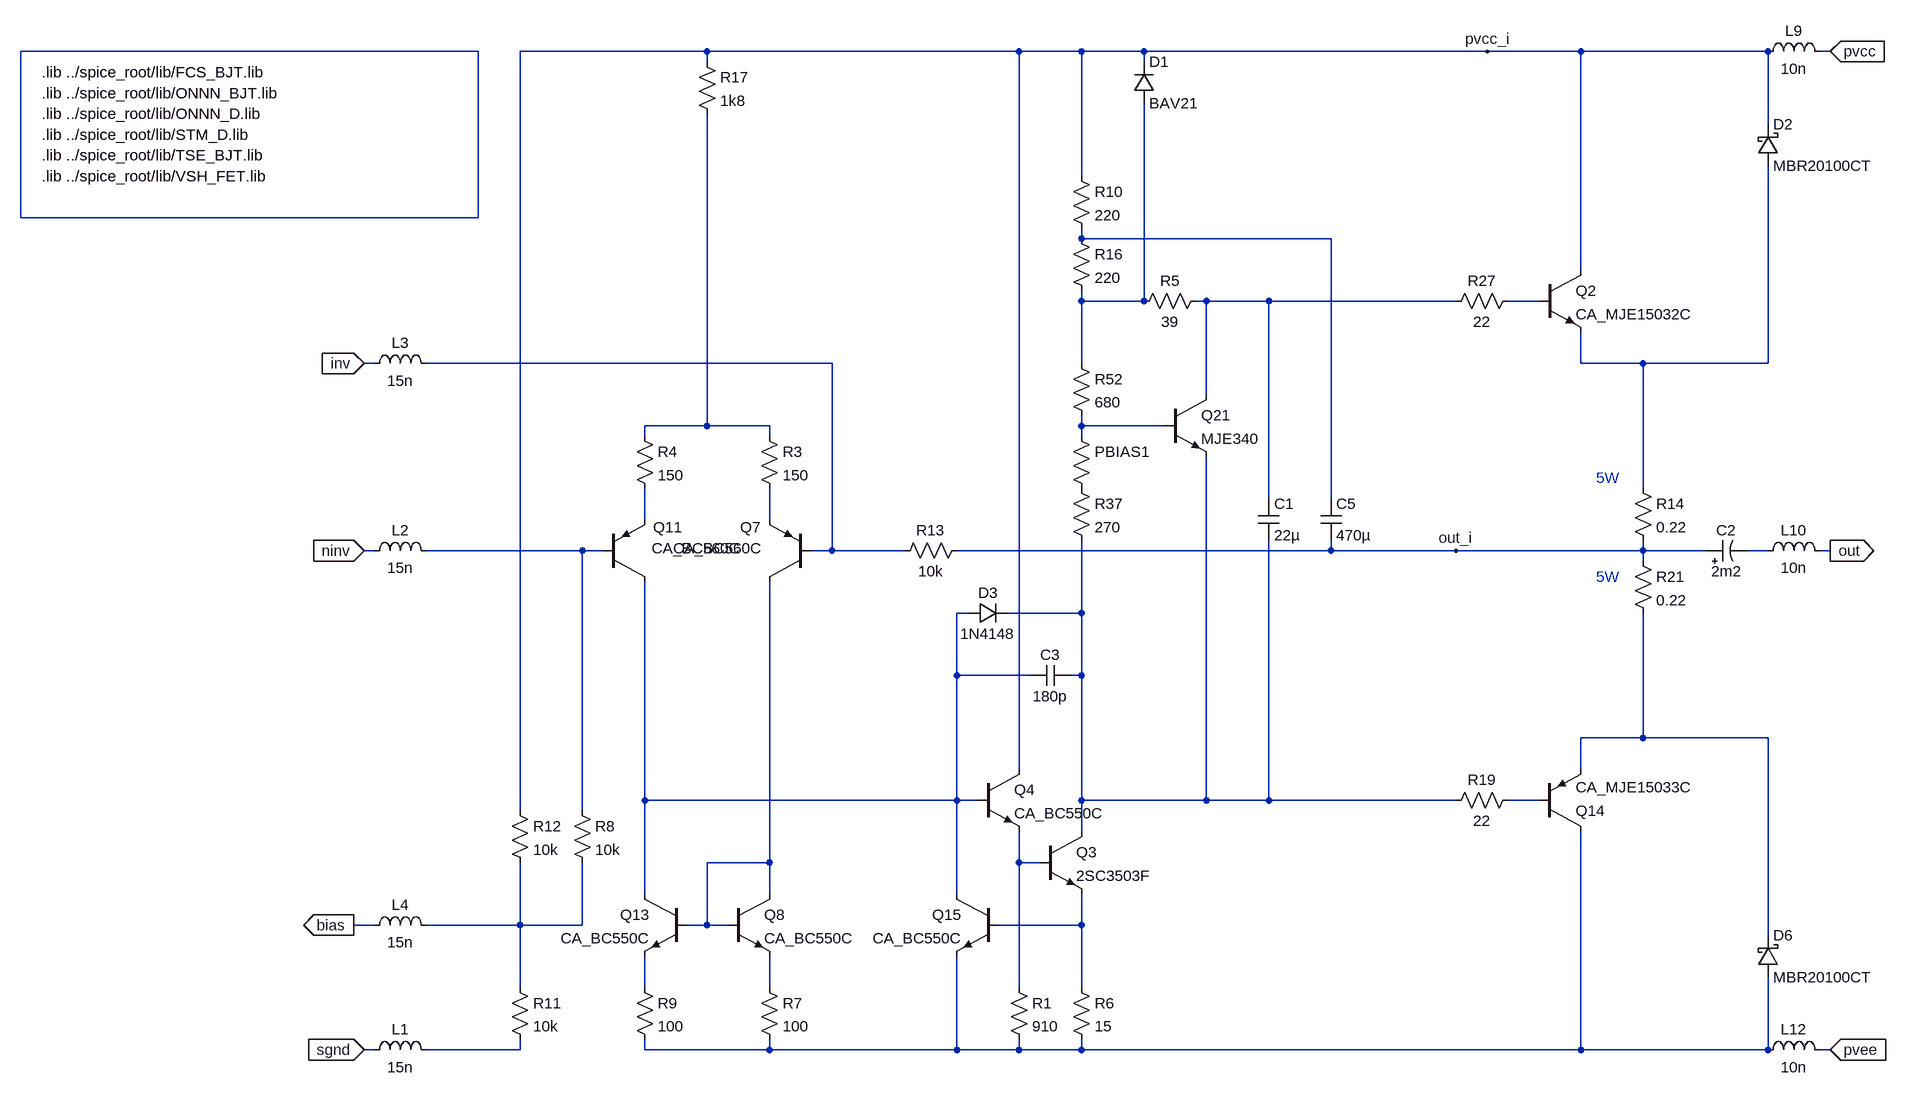
[diagram p0: schematic pab3bbb-sewa-module.asc]
pab3bbb-sewa-module.asc, the LTspice schematic file:
Version 4
SHEET 1 6124 2336
WIRE 160 -992 -128 -992
WIRE 640 -992 160 -992
WIRE 736 -992 640 -992
WIRE 832 -992 736 -992
WIRE 1360 -992 832 -992
WIRE 1504 -992 1360 -992
WIRE 1792 -992 1504 -992
WIRE 1888 -992 1872 -992
WIRE 160 -976 160 -992
WIRE 832 -976 832 -992
WIRE 1792 -880 1792 -992
WIRE 736 -800 736 -992
WIRE 736 -704 736 -720
WIRE 1120 -704 736 -704
WIRE 1504 -656 1504 -992
WIRE 736 -608 736 -624
WIRE 832 -608 832 -912
WIRE 832 -608 736 -608
WIRE 928 -608 912 -608
WIRE 1024 -608 928 -608
WIRE 1312 -608 1024 -608
WIRE 1440 -608 1392 -608
WIRE -352 -512 -368 -512
WIRE 352 -512 -272 -512
WIRE 736 -512 736 -608
WIRE 1504 -512 1504 -560
WIRE 1600 -512 1504 -512
WIRE 1792 -512 1792 -816
WIRE 1792 -512 1600 -512
WIRE 928 -464 928 -608
WIRE 160 -416 160 -896
WIRE 160 -416 64 -416
WIRE 256 -416 160 -416
WIRE 736 -416 736 -432
WIRE 864 -416 736 -416
WIRE 64 -400 64 -416
WIRE 256 -400 256 -416
WIRE 736 -400 736 -416
WIRE 1600 -320 1600 -512
WIRE 1024 -304 1024 -608
WIRE 1120 -304 1120 -704
WIRE 64 -272 64 -320
WIRE 256 -272 256 -320
WIRE -352 -224 -368 -224
WIRE -32 -224 -272 -224
WIRE 0 -224 -32 -224
WIRE 352 -224 352 -512
WIRE 352 -224 320 -224
WIRE 464 -224 352 -224
WIRE 1120 -224 1120 -240
WIRE 1120 -224 544 -224
WIRE 1312 -224 1120 -224
WIRE 1600 -224 1600 -240
WIRE 1600 -224 1312 -224
WIRE 1696 -224 1600 -224
WIRE 1792 -224 1760 -224
WIRE 1888 -224 1872 -224
WIRE 1600 -208 1600 -224
WIRE 560 -128 544 -128
WIRE 736 -128 736 -240
WIRE 736 -128 624 -128
WIRE 544 -32 544 -128
WIRE 656 -32 544 -32
WIRE 736 -32 736 -128
WIRE 736 -32 720 -32
WIRE 1600 64 1600 -128
WIRE 1600 64 1504 64
WIRE 1792 64 1600 64
WIRE 640 112 640 -992
WIRE 1504 112 1504 64
WIRE 64 160 64 -176
WIRE 544 160 544 -32
WIRE 544 160 64 160
WIRE 576 160 544 160
WIRE 736 160 736 -32
WIRE 928 160 928 -368
WIRE 928 160 736 160
WIRE 1024 160 1024 -240
WIRE 1024 160 928 160
WIRE 1312 160 1024 160
WIRE 1440 160 1392 160
WIRE -128 176 -128 -992
WIRE -32 176 -32 -224
WIRE 736 208 736 160
WIRE 256 256 256 -176
WIRE 256 256 160 256
WIRE 640 256 640 208
WIRE 672 256 640 256
WIRE 64 304 64 160
WIRE 256 304 256 256
WIRE 544 304 544 160
WIRE -352 352 -384 352
WIRE -128 352 -128 256
WIRE -128 352 -272 352
WIRE -32 352 -32 256
WIRE -32 352 -128 352
WIRE 160 352 160 256
WIRE 160 352 128 352
WIRE 192 352 160 352
WIRE 736 352 736 304
WIRE 736 352 608 352
WIRE 1792 368 1792 64
WIRE -128 448 -128 352
WIRE 64 448 64 400
WIRE 256 448 256 400
WIRE 640 448 640 256
WIRE 736 448 736 352
WIRE -352 544 -368 544
WIRE -128 544 -128 528
WIRE -128 544 -272 544
WIRE 64 544 64 528
WIRE 256 544 256 528
WIRE 256 544 64 544
WIRE 544 544 544 400
WIRE 544 544 256 544
WIRE 640 544 640 528
WIRE 640 544 544 544
WIRE 736 544 736 528
WIRE 736 544 640 544
WIRE 1504 544 1504 208
WIRE 1504 544 736 544
WIRE 1792 544 1792 432
WIRE 1792 544 1504 544
WIRE 1888 544 1872 544
FLAG 1888 -992 pvcc
IOPIN 1888 -992 In
FLAG 1888 544 pvee
IOPIN 1888 544 In
FLAG 1888 -224 out
IOPIN 1888 -224 Out
FLAG -368 -224 ninv
IOPIN -368 -224 In
FLAG -368 -512 inv
IOPIN -368 -512 In
FLAG 1360 -992 pvcc_i
FLAG 1312 -224 out_i
FLAG -368 544 sgnd
IOPIN -368 544 In
FLAG -384 352 bias
IOPIN -384 352 Out
SYMBOL pnp 0 -176 M180
WINDOW 0 77 84 Left 2
WINDOW 3 75 52 Left 2
SYMATTR InstName Q11
SYMATTR Value CA_BC560C
SYMBOL res 1408 -624 R90
WINDOW 0 0 56 VBottom 2
WINDOW 3 32 56 VTop 2
SYMATTR InstName R27
SYMATTR Value 22
SYMBOL res 720 -416 R0
WINDOW 3 36 76 Invisible 2
SYMATTR Value {1+(500*BIAS)}
SYMATTR InstName PBIAS1
SYMBOL res 720 -528 R0
SYMATTR InstName R52
SYMATTR Value 680
SYMBOL npn 672 208 R0
SYMATTR InstName Q3
SYMATTR Value 2SC3503F
SYMBOL res 720 432 R0
SYMATTR InstName R6
SYMATTR Value 15
SYMBOL pnp 320 -176 R180
WINDOW 0 77 84 Left 2
WINDOW 3 75 52 Left 2
SYMATTR InstName Q7
SYMATTR Value CA_BC560C
SYMBOL npn 864 -464 R0
SYMATTR InstName Q21
SYMATTR Value MJE340
SYMBOL res 720 -336 R0
SYMATTR InstName R37
SYMATTR Value 270
SYMBOL res 1584 -336 R0
SYMATTR InstName R14
SYMATTR Value 0.22
SYMBOL res 1584 -224 R0
SYMATTR InstName R21
SYMATTR Value 0.22
SYMBOL ind -368 -208 R270
WINDOW 0 32 56 VTop 2
WINDOW 3 5 56 VBottom 2
SYMATTR InstName L2
SYMATTR Value 15n
SYMATTR SpiceLine Rser=20m
SYMBOL ind -368 -496 R270
WINDOW 0 32 56 VTop 2
WINDOW 3 5 56 VBottom 2
SYMATTR InstName L3
SYMATTR Value 15n
SYMATTR SpiceLine Rser=20m
SYMBOL ind 1776 -208 R270
WINDOW 0 32 56 VTop 2
WINDOW 3 5 56 VBottom 2
SYMATTR InstName L10
SYMATTR Value 10n
SYMATTR SpiceLine Rser=10m
SYMBOL ind 1776 -976 R270
WINDOW 0 32 56 VTop 2
WINDOW 3 5 56 VBottom 2
SYMATTR InstName L9
SYMATTR Value 10n
SYMATTR SpiceLine Rser=10m
SYMBOL ind 1776 560 R270
WINDOW 0 32 56 VTop 2
WINDOW 3 5 56 VBottom 2
SYMATTR InstName L12
SYMATTR Value 10n
SYMATTR SpiceLine Rser=10m
SYMBOL res 1408 144 R90
WINDOW 0 0 56 VBottom 2
WINDOW 3 32 56 VTop 2
SYMATTR InstName R19
SYMATTR Value 22
SYMBOL cap 1008 -304 R0
SYMATTR InstName C1
SYMATTR Value 22µ
SYMATTR SpiceLine Rser=220m Lser=5n Rpar=800k Cpar=1p
SYMBOL res 48 -416 R0
SYMATTR InstName R4
SYMATTR Value 150
SYMBOL cap 720 -48 R90
WINDOW 0 0 32 VBottom 2
WINDOW 3 32 32 VTop 2
SYMATTR InstName C3
SYMATTR Value 180p
SYMATTR SpiceLine Rser=970m Lser=5n Rpar=2meg Cpar=1p
SYMBOL res 240 -416 R0
SYMATTR InstName R3
SYMATTR Value 150
SYMBOL npn 192 304 R0
SYMATTR InstName Q8
SYMATTR Value CA_BC550C
SYMBOL npn 128 304 M0
SYMATTR InstName Q13
SYMATTR Value CA_BC550C
SYMBOL res 144 -992 R0
SYMATTR InstName R17
SYMATTR Value 1k8
SYMBOL res 240 432 R0
SYMATTR InstName R7
SYMATTR Value 100
SYMBOL res 48 432 R0
SYMATTR InstName R9
SYMATTR Value 100
SYMBOL npn 1440 -656 R0
SYMATTR InstName Q2
SYMATTR Value CA_MJE15032C
SYMBOL pnp 1440 208 M180
SYMATTR InstName Q14
SYMATTR Value CA_MJE15033C
SYMBOL npn 576 112 R0
SYMATTR InstName Q4
SYMATTR Value CA_BC550C
SYMBOL res 624 432 R0
SYMATTR InstName R1
SYMATTR Value 910
SYMBOL res 928 -624 R90
WINDOW 0 0 56 VBottom 2
WINDOW 3 32 56 VTop 2
SYMATTR InstName R5
SYMATTR Value 39
SYMBOL diode 560 -112 R270
WINDOW 0 32 32 VTop 2
WINDOW 3 0 32 VBottom 2
SYMATTR InstName D3
SYMATTR Value 1N4148
SYMBOL npn 608 304 M0
SYMATTR InstName Q15
SYMATTR Value CA_BC550C
SYMBOL schottky 1776 -816 M180
WINDOW 0 24 64 Left 2
WINDOW 3 24 0 Left 2
SYMATTR InstName D2
SYMATTR Value MBR20100CT
SYMATTR Description Diode
SYMATTR Type diode
SYMBOL schottky 1776 432 M180
WINDOW 0 24 64 Left 2
WINDOW 3 24 0 Left 2
SYMATTR InstName D6
SYMATTR Value MBR20100CT
SYMATTR Description Diode
SYMATTR Type diode
SYMBOL res 720 -816 R0
SYMATTR InstName R10
SYMATTR Value 220
SYMBOL res 720 -720 R0
SYMATTR InstName R16
SYMATTR Value 220
SYMBOL cap 1104 -304 R0
SYMATTR InstName C5
SYMATTR Value 470µ
SYMATTR SpiceLine Rser=112m Lser=5n Rpar=600k Cpar=1p
SYMBOL diode 816 -912 M180
WINDOW 0 24 64 Left 2
WINDOW 3 24 0 Left 2
SYMATTR InstName D1
SYMATTR Value BAV21
SYMBOL res -48 160 R0
SYMATTR InstName R8
SYMATTR Value 10k
SYMBOL res -144 432 R0
SYMATTR InstName R11
SYMATTR Value 10k
SYMBOL res -144 160 R0
SYMATTR InstName R12
SYMATTR Value 10k
SYMBOL ind -368 560 R270
WINDOW 0 32 56 VTop 2
WINDOW 3 5 56 VBottom 2
SYMATTR InstName L1
SYMATTR Value 15n
SYMATTR SpiceLine Rser=20m
SYMBOL ind -368 368 R270
WINDOW 0 32 56 VTop 2
WINDOW 3 5 56 VBottom 2
SYMATTR InstName L4
SYMATTR Value 15n
SYMATTR SpiceLine Rser=20m
SYMBOL res 560 -240 R90
WINDOW 0 0 56 VBottom 2
WINDOW 3 32 56 VTop 2
SYMATTR InstName R13
SYMATTR Value 10k
SYMBOL polcap 1696 -208 R270
WINDOW 0 32 32 VTop 2
WINDOW 3 0 32 VBottom 2
SYMATTR InstName C2
SYMATTR Value 2m2
SYMATTR SpiceLine V=6.3 Irms=1.44 Rser=0.09 Lser=5.5n Rpar=1110k Cpar=3p
SYMATTR Description Capacitor
SYMATTR Type cap
TEXT 1528 -336 Left 2 ;5W
TEXT 1528 -184 Left 2 ;5W
TEXT -864 -928 Left 2 !.lib ../spice_root/lib/ONNN_BJT.lib
TEXT -864 -864 Left 2 !.lib ../spice_root/lib/STM_D.lib
TEXT -864 -960 Left 2 !.lib ../spice_root/lib/FCS_BJT.lib
TEXT -864 -896 Left 2 !.lib ../spice_root/lib/ONNN_D.lib
TEXT -864 -832 Left 2 !.lib ../spice_root/lib/TSE_BJT.lib
TEXT -864 -800 Left 2 !.lib ../spice_root/lib/VSH_FET.lib
RECTANGLE Normal -192 -736 -896 -992

The netlist it stands for:
* pab3bbb-sewa-module.asc
Q11 N013 N011 N009 0 CA_BC560C
R27 N004 N003 22
R§PBIAS1 N008 P001 {1+(500*BIAS)}
R52 N002 N008 680
Q3 N014 N018 N020 0 2SC3503F
R6 N020 N024 15
Q7 N017 N005 N010 0 CA_BC560C
Q21 N003 N008 N014 0 MJE340
R37 P001 N014 270
R14 N006 out_i 0.22
R21 out_i N015 0.22
L2 ninv N011 15n Rser=20m
L3 inv N005 15n Rser=20m
L10 N012 out 10n Rser=10m
L9 pvcc_i pvcc 10n Rser=10m
L12 N024 pvee 10n Rser=10m
R19 N016 N014 22
C1 N003 N014 22µ Rser=220m Lser=5n Rpar=800k Cpar=1p
R4 N007 N009 150
C3 N014 N013 180p Rser=970m Lser=5n Rpar=2meg Cpar=1p
R3 N007 N010 150
Q8 N017 N017 N022 0 CA_BC550C
Q13 N013 N017 N021 0 CA_BC550C
R17 pvcc_i N007 1k8
R7 N022 N024 100
R9 N021 N024 100
Q2 pvcc_i N004 N006 0 CA_MJE15032C
Q14 N024 N016 N015 0 CA_MJE15033C
Q4 pvcc_i N013 N018 0 CA_BC550C
R1 N018 N024 910
R5 N003 N002 39
D3 N013 N014 1N4148
Q15 N013 N020 N024 0 CA_BC550C
D2 N006 pvcc_i MBR20100CT
D6 N024 N015 MBR20100CT
R10 pvcc_i N001 220
R16 N001 N002 220
C5 N001 out_i 470µ Rser=112m Lser=5n Rpar=600k Cpar=1p
D1 N002 pvcc_i BAV21
R8 N011 N019 10k
R11 N019 N023 10k
R12 pvcc_i N019 10k
L1 sgnd N023 15n Rser=20m
L4 bias N019 15n Rser=20m
R13 out_i N005 10k
C2 out_i N012 2m2 V=6.3 Irms=1.44 Rser=0.09 Lser=5.5n Rpar=1110k Cpar=3p
.model D D
.lib standard.dio
.model NPN NPN
.model PNP PNP
.lib standard.bjt
* 5W
* 5W
.lib ../spice_root/lib/ONNN_BJT.lib
.lib ../spice_root/lib/STM_D.lib
.lib ../spice_root/lib/FCS_BJT.lib
.lib ../spice_root/lib/ONNN_D.lib
.lib ../spice_root/lib/TSE_BJT.lib
.lib ../spice_root/lib/VSH_FET.lib
.backanno
.end